# Altium schematic sheet H-Bridge_schematic.SchDoc
size A4; SheetNumber: 1; SheetTotal: 1; SPICEModelCachePNZEUDJA: <root> / <DocumentId>PNZEUDJA</DocumentId> / <CacheFrame Number="0"> / <Model Name="2n3904" Kind="MDL"> / <Text>*2N3904 / *Si 310mW  40V 200mA 300MHz pkg:TO-92B 1,2,3 / .MODEL 2N3904 NPN(IS=1.4E-14 BF=300 VAF=100 IKF=0.025 ISE=3E-13 / + BR=7.5 RC=2.4 CJE=4.5E-12 TF=4E-10 CJC=3.5E-12 TR=2.1E-8 XTB=1.5 KF=9E-16 )</Text> / </Model> / <Model Name="2n3906" Kind="MDL"> / <Text>*2N3906 / *Si 310mW  40V 200mA 250MHz pkg:TO-92B 1,2,3 / .MODEL 2N3906 PNP(IS=4E-14 BF=400 VAF=50 IKF=0.02 ISE=7E-15 NE=1.16 / + BR=7.5 RC=2.4 CJE=6.3E-12 VJE=0.75 TF=5E-10 CJC=5.8E-12 VJC=0.75 TR=2.3E-8 / + VJS=0.75 XTB=1.5 KF=6E-16 )</Text> / </Model> / <Model Name="1n914" Kind="MDL"> / <Text>.model 1N914 D(Is=0.1p Rs=16 CJO=2p Tt=12n Bv=100 Ibv=0.1p)</Text> / </Model> / </CacheFrame> / </root>
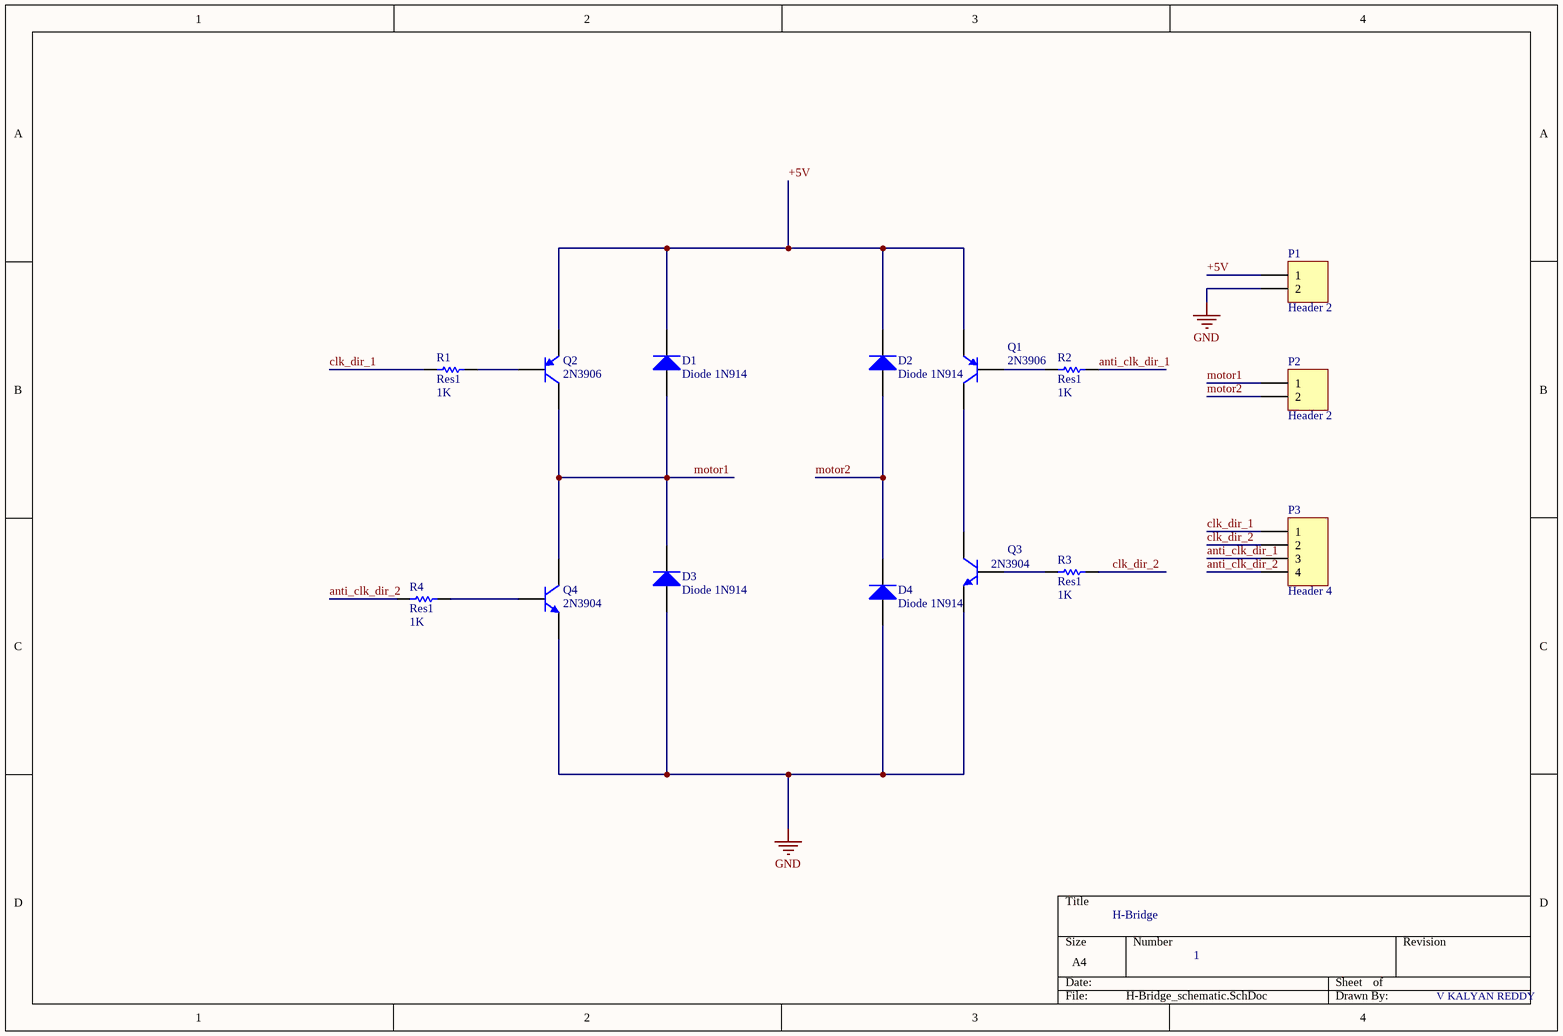
[diagram p0: H-Bridge_schematic.SchDoc]

## Parts
D1  Diode 1N914  [DO-35]
D2  Diode 1N914  [DO-35]
D3  Diode 1N914  [DO-35]
D4  Diode 1N914  [DO-35]
P1  Header 2  [HDR1X2]
P2  Header 2  [HDR1X2]
P3  Header 4  [HDR1X4]
Q1  2N3906  [TO-92A]
Q2  2N3906  [TO-92A]
Q3  2N3904  [TO-92A]
Q4  2N3904  [TO-92A]
R1  Res1  value 1K  [AXIAL-0.3]
R2  Res1  value 1K  [AXIAL-0.3]
R3  Res1  value 1K  [AXIAL-0.3]
R4  Res1  value 1K  [AXIAL-0.3]

## Nets
GND: D3.1(A) D4.1(A) P1.2 Q3.1(E) Q4.1(E)
+5V: D1.2(K) D2.2(K) P1.1 Q1.1(E) Q2.1(E)
anti_clk_dir_1: P3.3 R2.2
anti_clk_dir_2: P3.4 R4.1
clk_dir_1: P3.1 R1.1
clk_dir_2: P3.2 R3.2
motor1: D1.1(A) D3.2(K) P2.1 Q2.3(C) Q4.3(C)
motor2: D2.1(A) D4.2(K) P2.2
NetQ1_2: Q1.2(B) R2.1
NetQ1_3: Q1.3(C) Q3.3(C)
NetQ2_2: Q2.2(B) R1.2
NetQ3_2: Q3.2(B) R3.1
NetQ4_2: Q4.2(B) R4.2

## Notes on the sheet
- H-Bridge
- 1
- V KALYAN REDDY

## Library data of the parts
D1-D4 = Diode 1N914: High Conductance Fast Diode; Published: 8-Jun-2000; LatestRevisionDate: 17-Jul-2002; LatestRevisionNote: Re-released for DXP Platform.; DatasheetVersion: 1997; PackageReference: DO-35; Publisher: Altium Limited; PackageDescription: Diode, Axial; Body 3.8 x 1.9 mm (LxDia. max), Lead Dia. 0.53 mm (max); Code_JEDEC: DO-204-AH; ComponentLink1Description: Manufacturer Link; ComponentLink1URL: http://www.fairchildsemi.com/; ComponentLink2Description: Datasheet; ComponentLink2URL: http://www.fairchildsemi.com/ds/1N%2F1N4448.pdf
P1 P2 = Header 2: Header, 2-Pin; LatestRevisionDate: 17-Jul-2002; LatestRevisionNote: Re-released for DXP Platform.; Publisher: Altium Limited
P3 = Header 4: Header, 4-Pin; LatestRevisionDate: 17-Jul-2002; LatestRevisionNote: Re-released for DXP Platform.; Publisher: Altium Limited
Q1 Q2 = 2N3906: PNP General Purpose Amplifier; Published: 8-Jun-2000; LatestRevisionDate: 15-Jan-2003; LatestRevisionNote: PCB Footprint 'BCY-W3/D4.7' replaced; DatasheetVersion: 1997; PackageVersion: Sep-1998; PackageReference: TO-92A; Publisher: Altium Limited; PackageDescription: TO, Flat Index; 3 In-Line, Axial Leads; Body Dia. 4.5mm; Leads 0.51 x 0.48 mm (max); ComponentLink1Description: Manufacturer Link; ComponentLink1URL: http://www.fairchildsemi.com/; ComponentLink2Description: Datasheet; ComponentLink2URL: http://www.fairchildsemi.com/ds/2N%2F2N3906.pdf
Q3 Q4 = 2N3904: NPN General Purpose Amplifier; Published: 8-Jun-2000; LatestRevisionDate: 15-Jan-2003; LatestRevisionNote: PCB Footprint 'BCY-W3/D4.7' replaced; DatasheetVersion: 1997; PackageVersion: Sep-1998; PackageReference: TO-92A; Publisher: Altium Limited; PackageDescription: TO, Flat Index; 3 In-Line, Axial Leads; Body Dia. 4.5mm; Leads 0.51 x 0.48 mm (max); ComponentLink1Description: Manufacturer Link; ComponentLink1URL: http://www.fairchildsemi.com/; ComponentLink2Description: Datasheet; ComponentLink2URL: http://www.fairchildsemi.com/ds/2N%2F2N3904.pdf
R1-R4 = Res1: Resistor; Published: 8-Jun-2000; LatestRevisionDate: 17-Jul-2002; LatestRevisionNote: Re-released for DXP Platform.; PackageReference: AXIAL-0.3; Publisher: Altium Limited; PackageDescription: Axial Device, Thru-Hole; 2 Leads; 0.3 in Pin Spacing